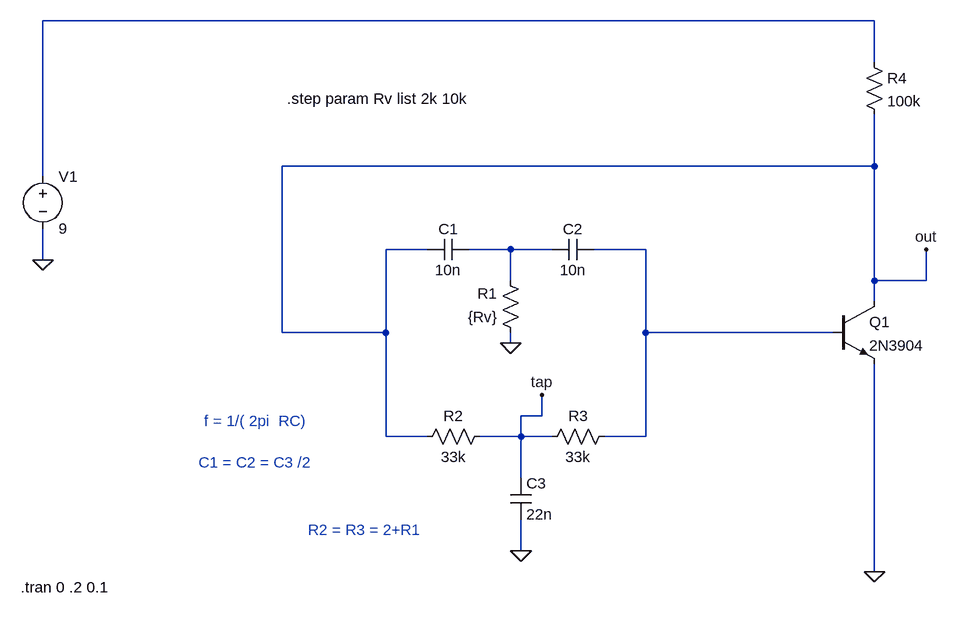
[diagram p0: schematic twin-t-osc-0v01.asc]
twin-t-osc-0v01.asc, the LTspice schematic file:
Version 4
SHEET 1 888 680
WIRE 768 -240 -512 -240
WIRE 768 -176 768 -240
WIRE 768 -16 768 -96
WIRE 768 -16 -144 -16
WIRE -512 0 -512 -240
WIRE 80 112 16 112
WIRE 208 112 144 112
WIRE 272 112 208 112
WIRE 416 112 336 112
WIRE -512 128 -512 80
WIRE 208 160 208 112
WIRE 768 160 768 -16
WIRE 848 160 848 112
WIRE 848 160 768 160
WIRE 768 192 768 160
WIRE -144 240 -144 -16
WIRE 16 240 16 112
WIRE 16 240 -144 240
WIRE 416 240 416 112
WIRE 704 240 416 240
WIRE 208 256 208 240
WIRE 256 368 256 336
WIRE 256 368 224 368
WIRE 16 400 16 240
WIRE 80 400 16 400
WIRE 224 400 224 368
WIRE 224 400 160 400
WIRE 272 400 224 400
WIRE 416 400 416 240
WIRE 416 400 352 400
WIRE 224 464 224 400
WIRE 224 576 224 528
WIRE 768 608 768 288
FLAG 208 256 0
FLAG 224 576 0
FLAG -512 128 0
FLAG 768 608 0
FLAG 848 112 out
FLAG 256 336 tap
SYMBOL cap 144 96 R90
WINDOW 0 0 32 VBottom 2
WINDOW 3 32 32 VTop 2
SYMATTR InstName C1
SYMATTR Value 10n
SYMBOL cap 336 96 R90
WINDOW 0 0 32 VBottom 2
WINDOW 3 32 32 VTop 2
SYMATTR InstName C2
SYMATTR Value 10n
SYMBOL res 224 256 R180
WINDOW 0 36 76 Left 2
WINDOW 3 36 40 Left 2
SYMATTR InstName R1
SYMATTR Value {Rv}
SYMBOL res 176 384 R90
WINDOW 0 0 56 VBottom 2
WINDOW 3 32 56 VTop 2
SYMATTR InstName R2
SYMATTR Value 33k
SYMBOL cap 208 464 R0
SYMATTR InstName C3
SYMATTR Value 22n
SYMBOL res 368 384 R90
WINDOW 0 0 56 VBottom 2
WINDOW 3 32 56 VTop 2
SYMATTR InstName R3
SYMATTR Value 33k
SYMBOL npn 704 192 R0
SYMATTR InstName Q1
SYMATTR Value 2N3904
SYMBOL res 752 -192 R0
SYMATTR InstName R4
SYMATTR Value 100k
SYMBOL voltage -512 -16 R0
WINDOW 123 0 0 Left 2
WINDOW 39 0 0 Left 2
SYMATTR InstName V1
SYMATTR Value 9
TEXT -104 544 Left 2 ;R2 = R3 = 2+R1
TEXT -546 632 Left 2 !.tran 0 .2 0.1
TEXT -136 -120 Left 2 !.step param Rv list 2k 10k
TEXT -264 376 Left 2 ;f = 1/( 2pi  RC)
TEXT -272 440 Left 2 ;C1 = C2 = C3 /2

The netlist it stands for:
* twin-t-osc-0v01.asc
C1 N002 out 10n
C2 N003 N002 10n
R1 0 N002 {Rv}
R2 tap out 33k
C3 tap 0 22n
R3 N003 tap 33k
Q1 out N003 0 0 2N3904
R4 N001 out 100k
V1 N001 0 9
.model NPN NPN
.model PNP PNP
.lib standard.bjt
* R2 = R3 = 2+R1
.tran 0 .2 0.1
.step param Rv list 2k 10k
* f = 1/( 2pi  RC)
* C1 = C2 = C3 /2
.backanno
.end